# EAGLE schematic cyrf6936-bob (EAGLE 6.4)
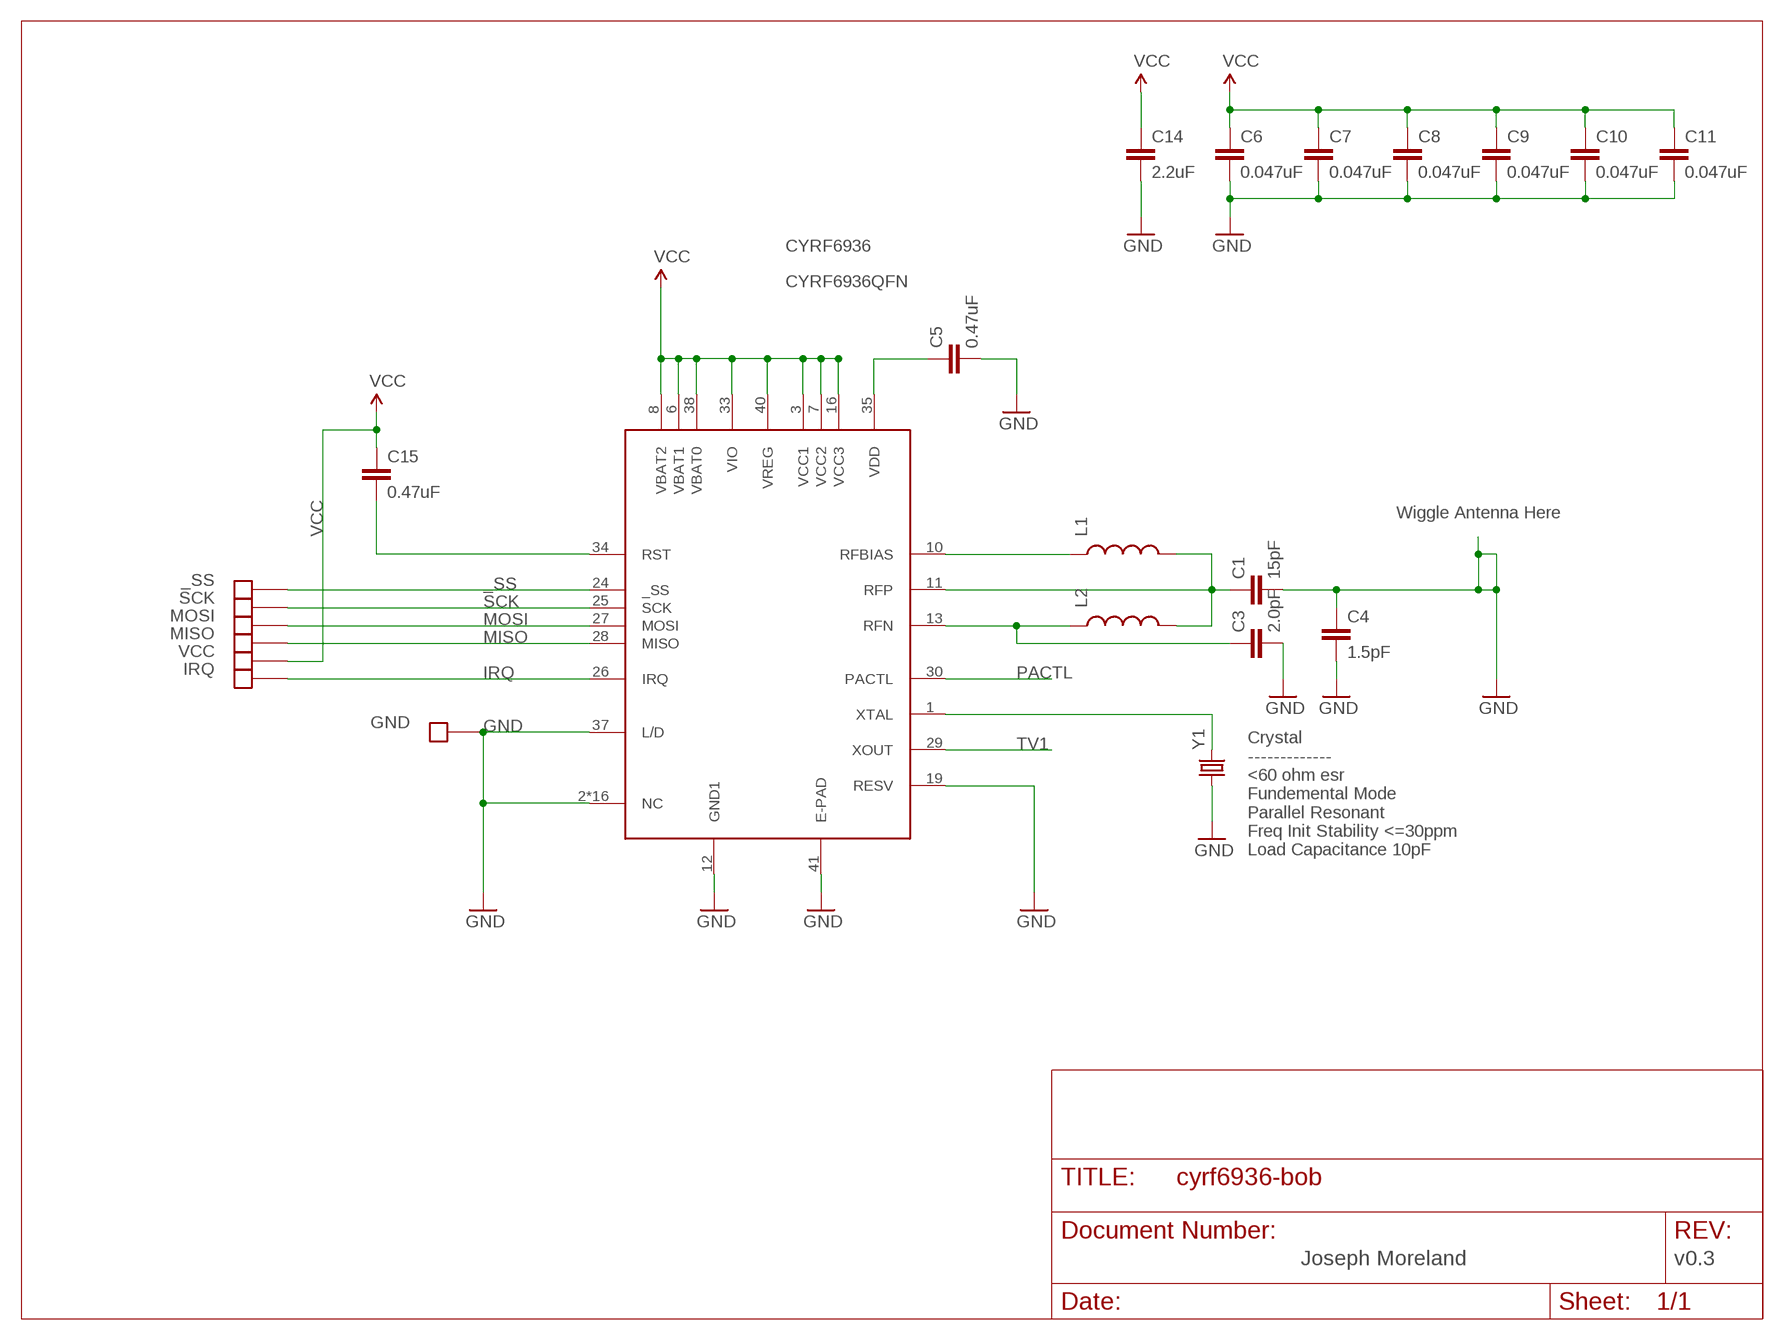
[diagram p0: schematic, sheet 1]

## Parts
_SS  SOLDER_PADTH  [1X1_50MIL]
C1  15pF  CAP0402-CAP  [0402-CAP]
C3  2.0pF  CAP0402-CAP  [0402-CAP]
C4  1.5pF  CAP0402-CAP  [0402-CAP]
C5  0.47uF  CAP0402-CAP  [0402-CAP]
C6  0.047uF  CAP0402-CAP  [0402-CAP]
C7  0.047uF  CAP0402-CAP  [0402-CAP]
C8  0.047uF  CAP0402-CAP  [0402-CAP]
C9  0.047uF  CAP0402-CAP  [0402-CAP]
C10  0.047uF  CAP0402-CAP  [0402-CAP]
C11  0.047uF  CAP0402-CAP  [0402-CAP]
C14  2.2uF  CAP0805  [0805]
C15  0.47uF  CAP0402-CAP  [0402-CAP]
CYRF6936  CYRF6936QFN  [QFN50P600X600X90-41N]
GND  SOLDER_PADTH  [1X1_50MIL]
IRQ  SOLDER_PADTH  [1X1_50MIL]
L1  INDUCTOR0603  [0603]
L2  INDUCTOR0402  [C0402]
MISO  SOLDER_PADTH  [1X1_50MIL]
MOSI  SOLDER_PADTH  [1X1_50MIL]
SCK  SOLDER_PADTH  [1X1_50MIL]
VCC  SOLDER_PADTH  [1X1_50MIL]
Y1  CRYSTAL5X3  [CRYSTAL-SMD-5X3]

## Nets
_SS: _SS.P$1(NET) CYRF6936.24(_SS)
GND: C1.2 C3.2 C4.1 C4.2 C5.2 C6.2 C7.2 C8.2 C9.2 C10.2 C11.2 C14.2 CYRF6936.2(NC) CYRF6936.4(NC) CYRF6936.5(NC) CYRF6936.9(NC) CYRF6936.12(GND1) CYRF6936.14(NC) CYRF6936.15(NC) CYRF6936.17(NC) CYRF6936.18(NC) CYRF6936.19(RESV) CYRF6936.20(NC) CYRF6936.21(NC) CYRF6936.22(NC) CYRF6936.23(NC) CYRF6936.31(NC) CYRF6936.32(NC) CYRF6936.36(NC) CYRF6936.37(L/D) CYRF6936.39(NC) CYRF6936.41(E-PAD) GND.P$1(NET) Y1.1
IRQ: CYRF6936.26(IRQ) IRQ.P$1(NET)
MISO: CYRF6936.28(MISO) MISO.P$1(NET)
MOSI: CYRF6936.27(MOSI) MOSI.P$1(NET)
N$2: CYRF6936.1(XTAL) Y1.3
PACTL: CYRF6936.30(PACTL)
RFBIAS: CYRF6936.10(RFBIAS) L1.1
RFN: C3.1 CYRF6936.13(RFN) L2.1
RFP: C1.1 CYRF6936.11(RFP) L1.2 L2.2
RST: C15.2 CYRF6936.34(RST)
SCK: CYRF6936.25(SCK) SCK.P$1(NET)
TV1: CYRF6936.29(XOUT)
VCC: C6.1 C7.1 C8.1 C9.1 C10.1 C11.1 C14.1 C15.1 CYRF6936.3(VCC1) CYRF6936.6(VBAT1) CYRF6936.7(VCC2) CYRF6936.8(VBAT2) CYRF6936.16(VCC3) CYRF6936.33(VIO) CYRF6936.38(VBAT0) CYRF6936.40(VREG) VCC.P$1(NET)
VDD: C5.1 CYRF6936.35(VDD)

## Notes on the sheet
- Wiggle Antenna Here
- Crystal
  -------------
  <60 ohm esr
  Fundemental Mode
  Parallel Resonant
  Freq Init Stability <=30ppm
  Load Capacitance 10pF
- Joseph Moreland | v0.3

## Library data of the parts
_SS GND IRQ MISO MOSI SCK VCC = JCM-Connectors:SOLDER_PAD
C1 = JCM-Capacitors:CAP: Capacitor Standard 0603 ceramic capacitor, and 0.1" leaded capacitor.; PARTNO: C0402C150J5GACTU; VOLT: 50
C3 = JCM-Capacitors:CAP: Capacitor Standard 0603 ceramic capacitor, and 0.1" leaded capacitor.; PARTNO: C0402C209C5GACTU; VOLT: 50
C4 = JCM-Capacitors:CAP: Capacitor Standard 0603 ceramic capacitor, and 0.1" leaded capacitor.; PARTNO: C0402C159B5GACTU; VOLT: 50
C5 C15 = JCM-Capacitors:CAP: Capacitor Standard 0603 ceramic capacitor, and 0.1" leaded capacitor.; PARTNO: GRM155R60J474KE19D; VOLT: 6.3
C6-C11 = JCM-Capacitors:CAP: Capacitor Standard 0603 ceramic capacitor, and 0.1" leaded capacitor.; PARTNO: 0402YD473KAT2A
C14 = JCM-Capacitors:CAP: Capacitor Standard 0603 ceramic capacitor, and 0.1" leaded capacitor.; PARTNO: GRM21BR71A225KA01L
CYRF6936 = JCM-IC:CYRF6936; PARTNO: CYRF6936B-40LTXC
L1 = SparkFun-Passives:INDUCTOR: Inductors Basic Inductor/Choke - 0603 and 1206. Footprints are not proven and vary greatly between part numbers.; PARTNO: ELJ-RE22NGFA
L2 = SparkFun-Passives:INDUCTOR: Inductors Basic Inductor/Choke - 0603 and 1206. Footprints are not proven and vary greatly between part numbers.; PARTNO: ELJ-RF1N8DFB
Y1 = SparkFun-FreqCtrl:CRYSTAL: Various standard crystals. Proven footprints. Spark Fun Electronics SKU : COM-00534; PARTNO: 7B-12.000MEEQ-T

## Net classes
0 default: width 0.203 mm, drill 0.305 mm